# EAGLE design equalizer (EAGLE 9.6.2)
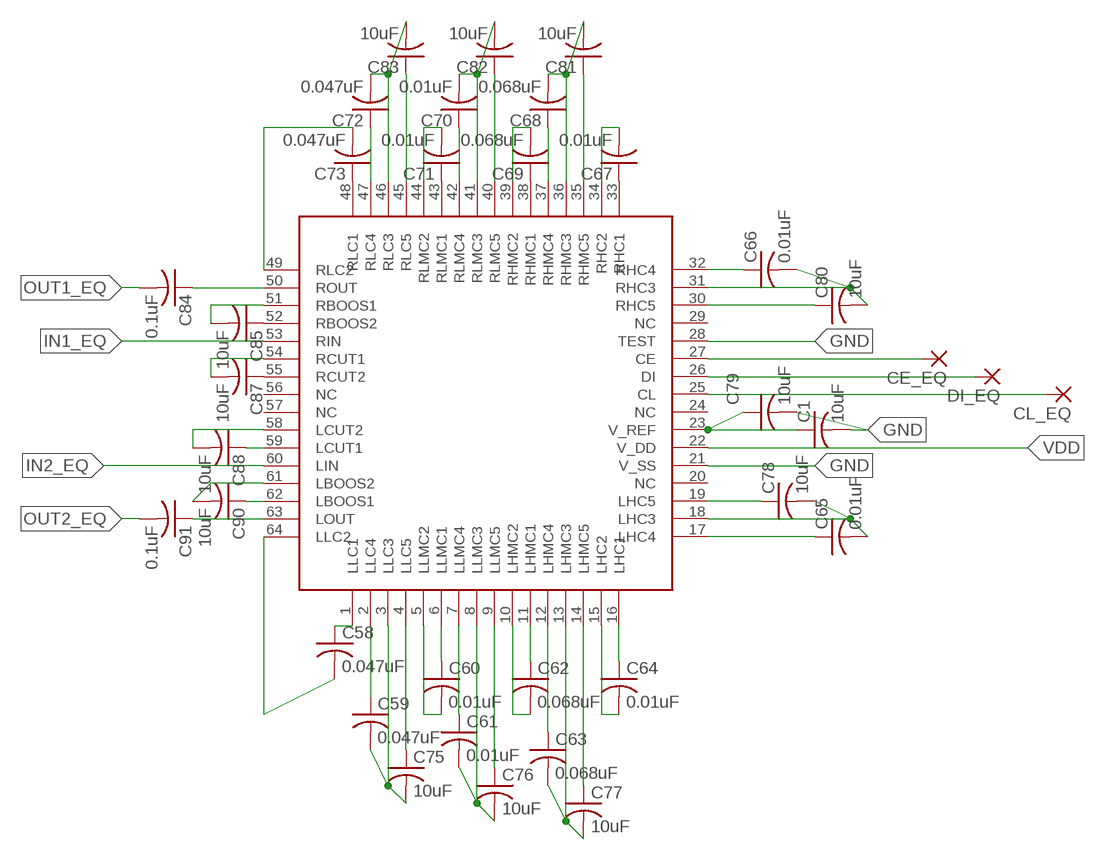
[diagram p0: schematic, sheet 1]

## Parts
C1  10uF  C-USC0402  [C0402]
C58  0.047uF  C-USC0402  [C0402]
C59  0.047uF  C-USC0402  [C0402]
C60  0.01uF  C-USC0402  [C0402]
C61  0.01uF  C-USC0402  [C0402]
C62  0.068uF  C-USC0402  [C0402]
C63  0.068uF  C-USC0402  [C0402]
C64  0.01uF  C-USC0402  [C0402]
C65  0.01uF  C-USC0402  [C0402]
C66  0.01uF  C-USC0402  [C0402]
C67  0.01uF  C-USC0402  [C0402]
C68  0.068uF  C-USC0402  [C0402]
C69  0.068uF  C-USC0402  [C0402]
C70  0.01uF  C-USC0402  [C0402]
C71  0.01uF  C-USC0402  [C0402]
C72  0.047uF  C-USC0402  [C0402]
C73  0.047uF  C-USC0402  [C0402]
C75  10uF  C-USC0402  [C0402]
C76  10uF  C-USC0402  [C0402]
C77  10uF  C-USC0402  [C0402]
C78  10uF  C-USC0402  [C0402]
C79  10uF  C-USC0402  [C0402]
C80  10uF  C-USC0402  [C0402]
C81  10uF  C-USC0402  [C0402]
C82  10uF  C-USC0402  [C0402]
C83  10uF  C-USC0402  [C0402]
C84  0.1uF  C-USC0402  [C0402]
C85  10uF  C-USC0402  [C0402]
C87  10uF  C-USC0402  [C0402]
C88  10uF  C-USC0402  [C0402]
C90  10uF  C-USC0402  [C0402]
C91  0.1uF  C-USC0402  [C0402]
CE_EQ  SMD2  [SMD1,27-2,54]
CL_EQ  SMD2  [SMD1,27-2,54]
DI_EQ  SMD2  [SMD1,27-2,54]
U$14  LC75281E  [QFP80P1720X1720X270-64N]

## Nets
EQ1_CE: CE_EQ.1(P) U$14.27(CE)
EQ1_CL: CL_EQ.1(P) U$14.25(CL)
EQ1_DI: DI_EQ.1(P) U$14.26(DI)
GND: C1.2 C79.2 U$14.21(V_SS) U$14.28(TEST)
IN1_EQ: U$14.53(RIN)
IN2_EQ: U$14.60(LIN)
N$1: C59.1 U$14.2(LLC4)
N$123: C58.1 U$14.1(LLC1)
N$125: C60.1 U$14.6(LLMC1)
N$126: C61.1 U$14.7(LLMC4)
N$127: C62.1 U$14.11(LHMC1)
N$128: C63.1 U$14.12(LHMC4)
N$129: C64.1 U$14.16(LHC1)
N$130: C65.1 U$14.17(LHC4)
N$133: C66.1 U$14.32(RHC4)
N$134: C67.1 U$14.33(RHC1)
N$180: C68.1 U$14.37(RHMC4)
N$181: C69.1 U$14.38(RHMC1)
N$182: C70.1 U$14.42(RLMC4)
N$183: C71.1 U$14.43(RLMC1)
N$184: C72.1 U$14.47(RLC4)
N$185: C73.1 U$14.48(RLC1)
N$186: C58.2 U$14.64(LLC2)
N$187: C59.2 C75.2 U$14.3(LLC3)
N$188: C75.1 U$14.4(LLC5)
N$189: C76.1 U$14.9(LLMC5)
N$190: C77.1 U$14.14(LHMC5)
N$191: C78.1 U$14.19(LHC5)
N$192: C1.1 C79.1 U$14.23(V_REF)
N$193: C80.1 U$14.30(RHC5)
N$194: C81.1 U$14.35(RHMC5)
N$195: C82.1 U$14.40(RLMC5)
N$196: C83.1 U$14.45(RLC5)
N$197: C84.1 U$14.50(ROUT)
N$198: C85.1 U$14.52(RBOOS2)
N$200: C87.1 U$14.55(RCUT2)
N$201: C88.1 U$14.59(LCUT1)
N$203: C90.1 U$14.62(LBOOS1)
N$204: C91.1 U$14.63(LOUT)
N$205: C60.2 U$14.5(LLMC2)
N$206: C61.2 C76.2 U$14.8(LLMC3)
N$207: C62.2 U$14.10(LHMC2)
N$208: C63.2 C77.2 U$14.13(LHMC3)
N$209: C64.2 U$14.15(LHC2)
N$210: C65.2 C78.2 U$14.18(LHC3)
N$211: C66.2 C80.2 U$14.31(RHC3)
N$212: C67.2 U$14.34(RHC2)
N$213: C68.2 C81.2 U$14.36(RHMC3)
N$214: C69.2 U$14.39(RHMC2)
N$215: C70.2 C82.2 U$14.41(RLMC3)
N$216: C71.2 U$14.44(RLMC2)
N$217: C72.2 C83.2 U$14.46(RLC3)
N$218: C73.2 U$14.49(RLC2)
N$219: C85.2 U$14.51(RBOOS1)
N$221: C87.2 U$14.54(RCUT1)
N$222: C88.2 U$14.58(LCUT2)
N$224: C90.2 U$14.61(LBOOS2)
OUT1_EQ: C84.2
OUT2_EQ: C91.2
VDD: U$14.22(V_DD)
Unconnected: U$14.20(NC) U$14.24(NC) U$14.29(NC) U$14.56(NC) U$14.57(NC)

## Library data of the parts
C1 C58-C73 C75-C85 C87 C88 C90 C91 = rcl:C-US: CAPACITOR, American symbol; SPICEPREFIX: C
CE_EQ CL_EQ DI_EQ = wirepad:SMD2: SMD PAD
U$14 = LC75281E:LC75281E

## Board
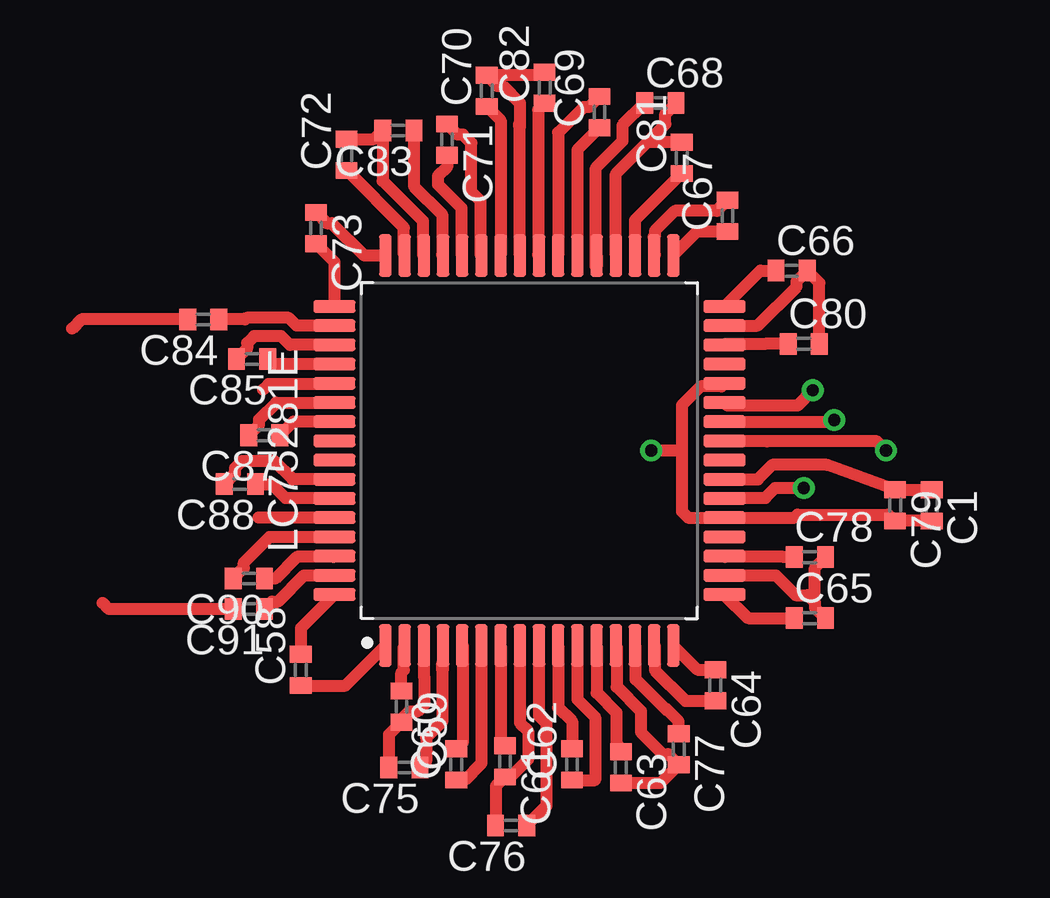
[diagram p1: board, top side]
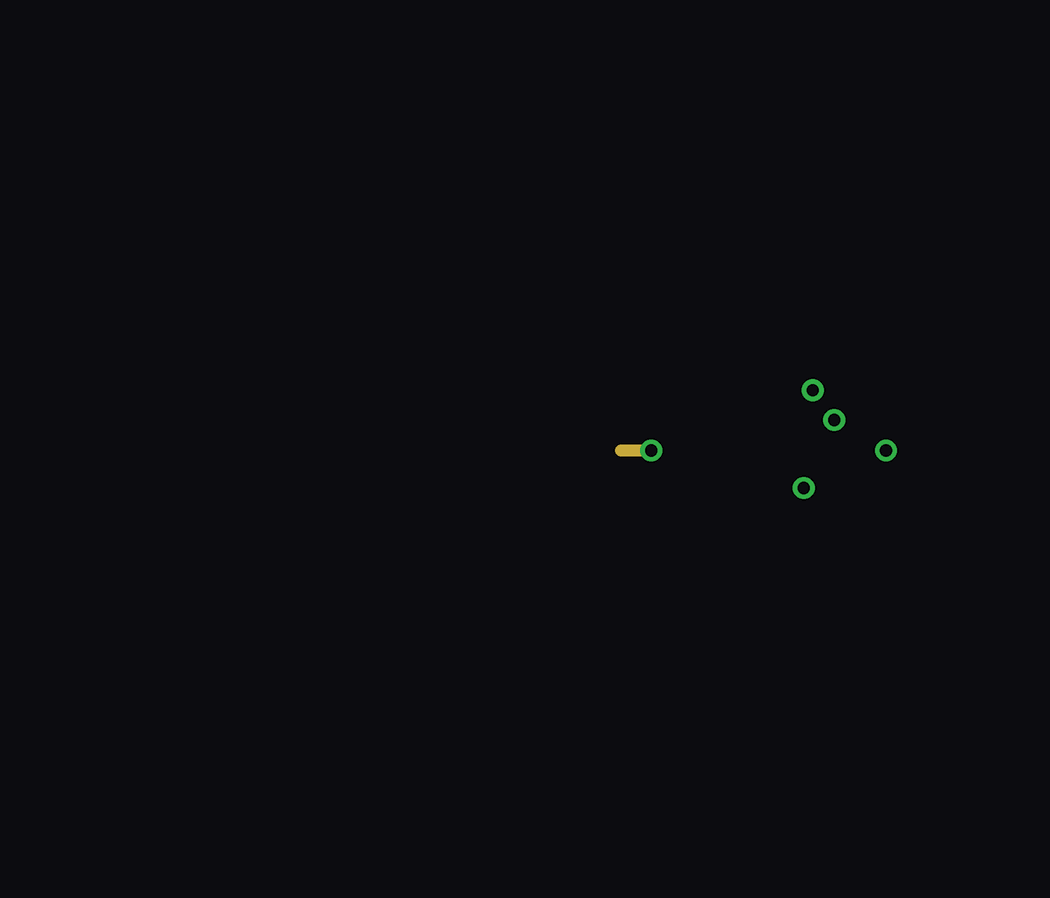
[diagram p2: board, inner layer Route2]
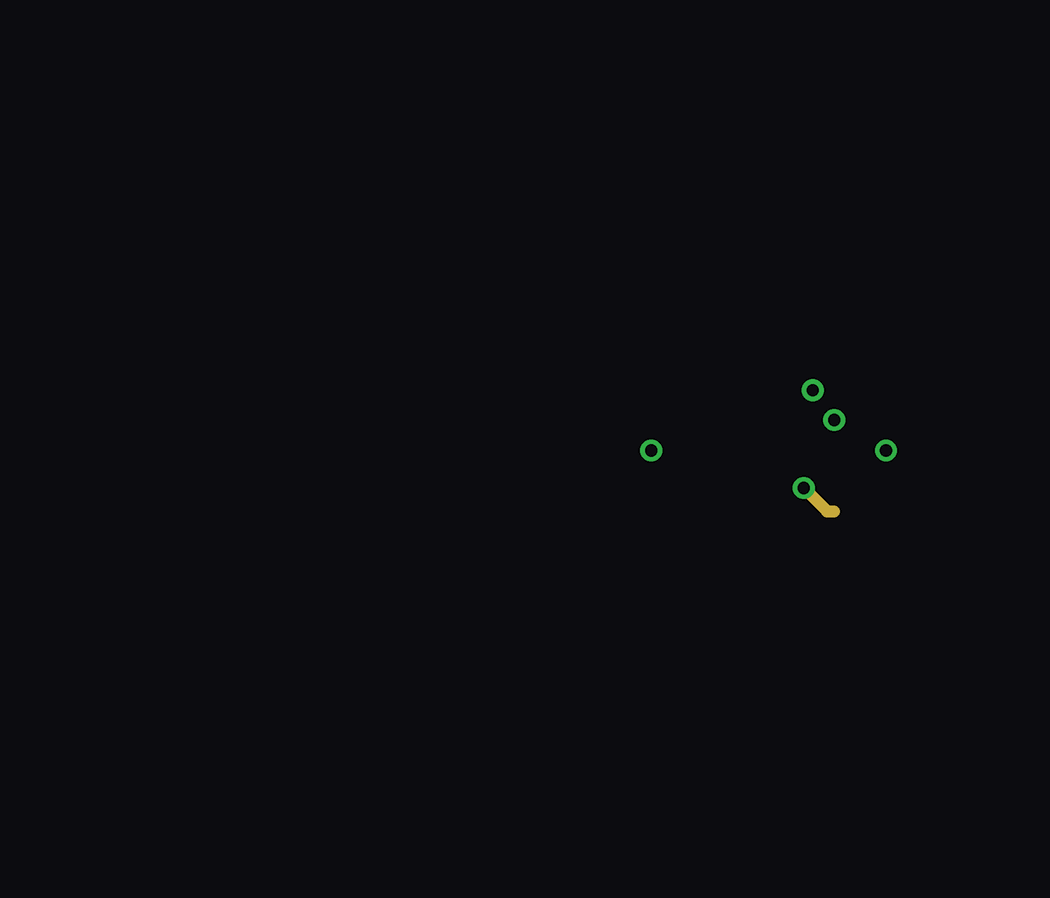
[diagram p3: board, inner layer Route15]
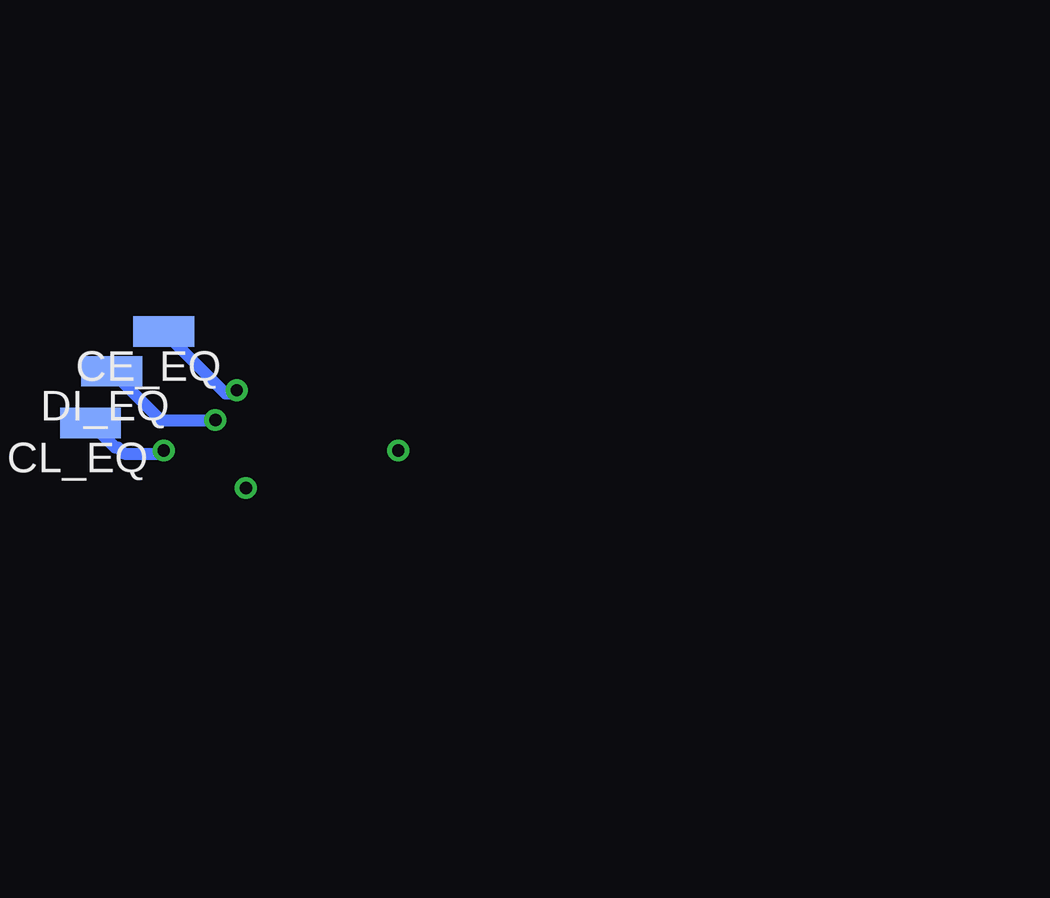
[diagram p4: board, bottom side, seen from below]

No outline drawn. Coordinates in mm, seen from the top.
Copper layers (1+2*15+16): Top 0.035mm / dielectric 0.2mm / Route2 0.035mm / dielectric 1mm / Route15 0.035mm / dielectric 0.2mm / Bottom 0.035mm
Design rules "default *": minimum track width 6mil, minimum drill 0.35mm, track to track 6mil, track to pad 6mil, pad to pad 6mil, via to via 6mil, smd to smd 6mil, copper to edge 40mil, drill to drill 6mil, minimum pad ring 10mil, minimum via ring 8mil, stop-mask expansion 4mil, vias tented up to drill 0mil, thermal gap 10mil

### Footprints (pad centres in the part's own frame; a part is rotated, then mirrored left to right if it is on the bottom)
C0402 = smd 0.7 x 0.9: 1 -0.65,0; 2 0.65,0
SMD1,27-2,54 = smd 1.27 x 2.54: 1 0,0
QFP80P1720X1720X270-64N = smd 1.758 x 0.522: 1 -8.127,6; 2 -8.127,5.2; 3 -8.127,4.4; 4 -8.127,3.6; 5 -8.127,2.8; 6 -8.127,2; 7 -8.127,1.2; 8 -8.127,0.4; 9 -8.127,-0.4; 10 -8.127,-1.2; 11 -8.127,-2; 12 -8.127,-2.8; 13 -8.127,-3.6; 14 -8.127,-4.4; 15 -8.127,-5.2; 16 -8.127,-6; 33 8.127,-6; 34 8.127,-5.2; 35 8.127,-4.4; 36 8.127,-3.6; 37 8.127,-2.8; 38 8.127,-2; 39 8.127,-1.2; 40 8.127,-0.4; 41 8.127,0.4; 42 8.127,1.2; 43 8.127,2; 44 8.127,2.8; 45 8.127,3.6; 46 8.127,4.4; 47 8.127,5.2; 48 8.127,6 | smd 0.522 x 1.758: 17 -6,-8.127; 18 -5.2,-8.127; 19 -4.4,-8.127; 20 -3.6,-8.127; 21 -2.8,-8.127; 22 -2,-8.127; 23 -1.2,-8.127; 24 -0.4,-8.127; 25 0.4,-8.127; 26 1.2,-8.127; 27 2,-8.127; 28 2.8,-8.127; 29 3.6,-8.127; 30 4.4,-8.127; 31 5.2,-8.127; 32 6,-8.127; 49 6,8.127; 50 5.2,8.127; 51 4.4,8.127; 52 3.6,8.127; 53 2.8,8.127; 54 2,8.127; 55 1.2,8.127; 56 0.4,8.127; 57 -0.4,8.127; 58 -1.2,8.127; 59 -2,8.127; 60 -2.8,8.127; 61 -3.6,8.127; 62 -4.4,8.127; 63 -5.2,8.127; 64 -6,8.127

### Placement (x,y rotation side)
C1  38.35,16.76 270 top
C58  12.06,9.91 90 top
C59  16.26,8.38 270 top
C60  18.54,5.97 90 top
C61  20.57,6.1 270 top
C62  23.37,5.97 90 top
C63  25.4,5.84 270 top
C64  29.34,9.27 270 top
C65  33.27,12.06 0 top
C66  32.51,26.54 0 top
C67  29.84,28.83 90 top
C68  27.05,33.53 0 top
C69  24.51,33.15 90 top
C70  19.81,34.04 90 top
C71  18.16,32 270 top
C72  13.97,31.37 90 top
C73  12.7,28.32 270 top
C75  16.38,5.84 180 top
C76  20.83,3.43 180 top
C77  27.81,6.6 270 top
C78  33.27,14.61 0 top
C79  36.83,16.76 270 top
C80  33.02,23.5 0 top
C81  27.94,31.24 90 top
C82  22.23,34.16 90 top
C83  16.13,32.38 180 top
C84  8,24.51 180 top
C85  10.03,22.86 180 top
C87  10.54,19.68 180 top
C88  9.53,17.65 180 top
C90  9.91,13.72 180 top
C91  9.91,12.45 180 top
CE_EQ  36.45,24 90 bottom
CL_EQ  39.5,20.19 90 bottom
DI_EQ  38.61,22.35 90 bottom
U$14  21.59,19.05 90 top

### Tracks (layer width: path | path; a pad name or v marks a point on that pad's centre or on a via)
EQ1_CE  (via drill 0.51)
  Top 0.508: U$14.27 29.84,20.92 32.77,20.92 v33.4,21.56
  Bottom 0.508: v33.4,21.56 33.4,21.43 33.88,21.43 CE_EQ.1
EQ1_CL  (via drill 0.51)
  Top 0.508: U$14.25 31.5,19.45 31.5,19.43 36.07,19.43 v36.45,19.05
  Bottom 0.508: v36.45,19.05 36.58,18.92 38.1,18.92 38.35,19.18 38.48,19.18 CL_EQ.1
EQ1_DI  (via drill 0.51)
  Top 0.508: U$14.26 34.22,20.25 v34.29,20.32
  Bottom 0.508: v34.29,20.32 36.58,20.32 DI_EQ.1
GND  (via drill 0.51)
  Top 0.508: U$14.28 29.58,21.72 28.73,21.72 27.94,20.93 27.94,19.05 | 27.94,19.05 27.94,16.51 28.2,16.25 U$14.21 32.64,16.25 32.77,16.38 36.53,16.38 C79.2 C1.2 | 27.94,19.05 v26.67,19.05
  Route2 0.508: v26.67,19.05 25.4,19.05
IN1_EQ
  Top 0.508: U$14.53 13.43,21.82 10.73,21.82 10.5,21.59
IN2_EQ
  Top 0.508: U$14.60 10.31,16.25
N$1
  Top 0.508: C59.1 16.26,9.79 16.36,9.89 16.36,10.89 U$14.2
N$123
  Top 0.508: C58.1 13.92,9.26 U$14.1
N$125
  Top 0.508: C60.1 18.89,5.32 19.59,6.02 U$14.6
N$126
  Top 0.508: C61.1 20.39,6.93 U$14.7
N$127
  Top 0.508: U$14.11 23.59,8.68 24.33,7.94 24.33,5.32 C62.1
N$128
  Top 0.508: U$14.12 24.39,8.96 25.21,8.13 25.21,6.97 C63.1
N$129
  Top 0.508: U$14.16 28.59,9.92 C64.1
N$130
  Top 0.508: U$14.17 30.7,12.06 C65.1
N$133
  Top 0.508: U$14.32 31.21,26.54 C66.1
N$134
  Top 0.508: U$14.33 28.59,28.18 C67.1
N$180
  Top 0.508: C68.1 25.47,32.6 25.47,31.94 24.36,30.83 24.36,26.67 24.39,26.7 U$14.37
N$181
  Top 0.508: C69.1 23.59,31.58 U$14.38
N$182
  Top 0.508: C70.1 20.39,32.81 U$14.42
N$183
  Top 0.508: U$14.43 19.56,27.21 19.56,29.44 19.18,29.82 19.18,31.86 18.82,32.21 18.6,32.21 C71.1
N$184
  Top 0.508: C72.1 16.36,28.33 16.36,27.21 U$14.47
N$185
  Top 0.508: C73.1 13.14,28.53 13.36,28.53 14.71,27.18 U$14.48
N$186
  Top 0.508: U$14.64 12.06,11.65 C58.2
N$187
  Top 0.508: U$14.3 17.19,9.62 17.21,9.59 17.21,8.47 16.92,8.17 16.57,8.17 16.26,7.86 C59.2 15.73,7.21 C75.2
N$188
  Top 0.508: C75.1 17.29,6.1 17.29,7.09 17.98,7.78 17.98,9.91 | 17.98,9.91 17.96,9.93 17.96,10.16 | U$14.4 17.99,9.92 17.98,9.91
N$189
  Top 0.508: U$14.9 21.99,7.99 22.29,7.68 22.29,4.25 C76.1
N$190
  Top 0.508: C77.1 27.81,7.76 27.3,8.27 27.3,8.23 26.02,9.51 26.02,10.89 U$14.14
N$191
  Top 0.508: C78.1 32.18,14.61 32.17,14.62 29.75,14.62 U$14.19
N$192
  Top 0.508: U$14.23 31.11,17.85 31.72,18.45 33.98,18.45 C79.1 C1.1
N$193
  Top 0.508: C80.1 31.41,23.5 31.4,23.48 29.75,23.48 U$14.30
N$194
  Top 0.508: C81.1 25.99,28.64 U$14.35
N$195
  Top 0.508: C82.1 21.96,33.25 21.96,27.21 U$14.40
N$196
  Top 0.508: C83.1 16.78,30.07 17.96,28.89 17.96,27.21 U$14.45
N$197
  Top 0.508: U$14.50 11.89,24.25 11.56,24.58 9.81,24.58 9.74,24.51 C84.1
N$198
  Top 0.508: U$14.52 10.89,22.65 C85.1
N$200
  Top 0.508: U$14.55 11.76,20.25 C87.1
N$201
  Top 0.508: U$14.59 13.43,17.08 11.42,17.08 10.85,17.65 C88.1
N$203
  Top 0.508: U$14.62 13.43,14.62 11.9,14.62 11,13.72 C90.1
N$204
  Top 0.508: C91.1 10.87,12.76 11.12,12.76 12.21,13.85 U$14.63
N$205
  Top 0.508: U$14.5 18.82,10.89 18.82,6.9 C60.2
N$206
  Top 0.508: U$14.8 21.19,7.71 21.53,7.37 21.53,6.19 20.68,5.34 C61.2 20.19,5.07 20.19,3.44 C76.2
N$207
  Top 0.508: U$14.10 22.79,8.34 23.37,7.76 C62.2
N$208
  Top 0.508: U$14.13 25.22,10.89 25.22,9.2 26.23,8.19 26.23,7.32 27.15,6.4 27.37,6.4 C77.2 27.05,5.19 C63.2
N$209
  Top 0.508: U$14.15 26.82,10.89 26.82,9.89 28.09,8.62 C64.2
N$210
  Top 0.508: U$14.18 31.86,13.85 32.69,13.02 33.18,13.02 33.48,12.72 | 33.48,12.72 33.48,12.51 C65.2 | 33.48,12.72 33.48,14.16 C78.2
N$211
  Top 0.508: U$14.31 31.09,24.25 32.72,25.88 32.72,26.1 C66.2 33.67,26.04 C80.2
N$212
  Top 0.508: C67.2 29.4,29.04 27.65,29.04 26.82,28.2 26.82,28 | 26.82,28 26.76,27.94 | U$14.34 26.82,27.21 26.82,28
N$213
  Top 0.508: U$14.36 25.19,30.58 26.52,31.91 | C68.2 27.26,33.09 27.26,32.65 26.52,31.91 | C81.2 26.53,31.89 26.52,31.91
N$214
  Top 0.508: C69.2 24.07,33.35 23.85,33.35 22.79,32.29 U$14.39
N$215
  Top 0.508: U$14.41 21.19,32.53 | 21.19,32.53 21.15,32.57 21.15,32.64 | 21.19,32.53 21.19,33.53 20.47,34.24 20.25,34.24 C70.2 22.1,34.69 C82.2
N$216
  Top 0.508: C71.2 18.16,30.86 17.78,30.48 17.78,30.14 18.76,29.16 18.76,27.21 U$14.44
N$217
  Top 0.508: C72.2 15.11,32.02 C83.2 15.48,30.29 17.16,28.61 17.16,27.21 U$14.46
N$218
  Top 0.508: C73.2 13.46,26.91 U$14.49
N$219
  Top 0.508: C85.2 9.82,23.3 9.82,23.52 10.12,23.82 11.24,23.82 11.61,23.45 U$14.51
N$221
  Top 0.508: C87.2 10.33,20.13 10.33,20.34 11.04,21.05 U$14.54
N$222
  Top 0.508: C88.2 9.32,18.09 9.32,18.31 9.62,18.61 10.97,18.61 11.73,17.85 U$14.58
N$224
  Top 0.508: C90.2 9.7,14.16 9.7,14.38 10.77,15.45 U$14.61
OUT1_EQ
  Top 0.508: C84.2 2.92,24.51 2.54,24.13
OUT2_EQ
  Top 0.508: C91.2 4.06,12.45 3.81,12.7
VDD  (via drill 0.51)
  Top 0.508: U$14.22 29.75,17.08 31.42,17.08 31.83,17.49 v33.02,17.49
  Route15 0.508: v33.02,17.49 34,16.51 34.29,16.51